# Altium schematic sheet uart.SchDoc: Zillion - Z80 Single Board Computer
size A4; Author: Francesco Sacco; Revision: 0; ProjectName: Zillion - Z80 Single Board Computer
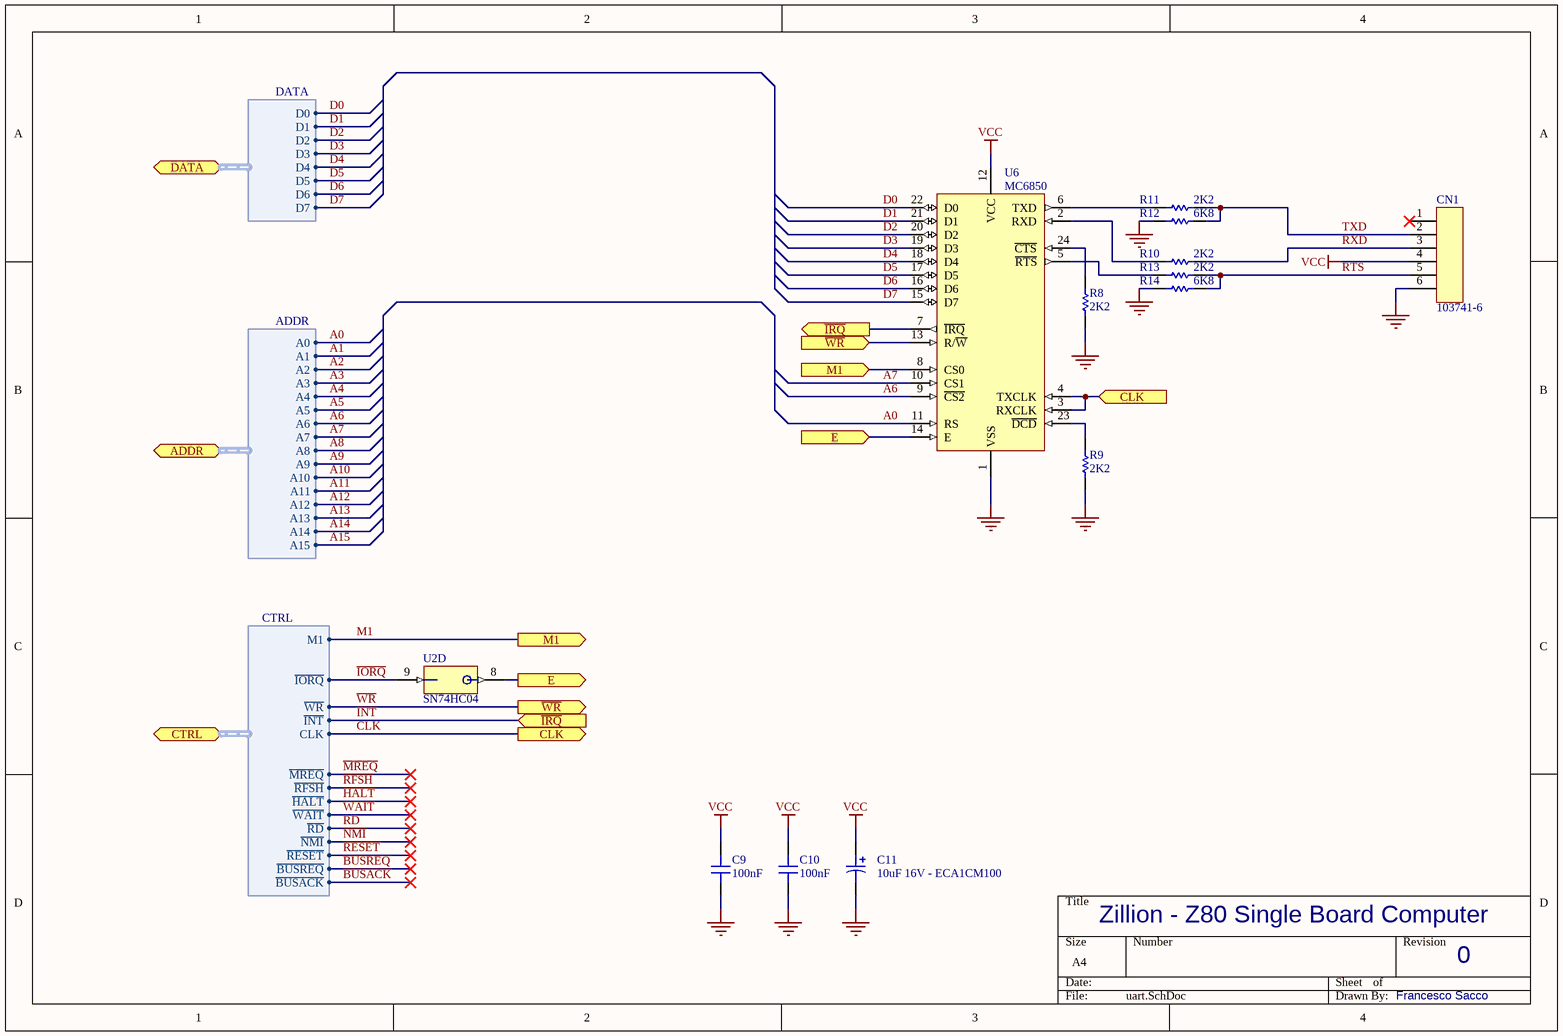
[diagram p0: uart.SchDoc]

## Parts
C9  100nF  [DiskCapacitor]
C10  100nF  [DiskCapacitor]
C11  10uF 16V - ECA1CM100  [ECA 5x11]
CN1  103741-6  [103741-6]
R8  2K2  [CR12]
R9  2K2  [CR12]
R10  2K2  [CR12]
R11  2K2  [CR12]
R12  6K8  [CR12]
R13  2K2  [CR12]
R14  6K8  [CR12]
U2  SN74HC04  [TSSOP14]  (part D of 7)
U6  MC6850  [PDIP24]

## Ports
ADDR (harness ADDR), CLK (in), CLK (out), CTRL (harness CTRL), DATA (harness DATA), E (in), E (out), M1 (in), M1 (out), ~{IRQ} (in), ~{IRQ} (out), ~{WR} (in), ~{WR} (out)

## Harnesses
ADDR: A0, A1, A2, A3, A4, A5, A6, A7, A8, A9, A10, A11, A12, A13, A14, A15
DATA: D0, D1, D2, D3, D4, D5, D6, D7
CTRL: M1, ~{MREQ}, ~{IORQ}, ~{RD}, ~{WR}, ~{RFSH}, ~{HALT}, ~{WAIT}, ~{INT}, ~{NMI}, ~{RESET}, ~{BUSREQ}, ~{BUSACK}, CLK

## Nets
GND: C9.1 C10.1 C11.2 CN1.6 R8.1 R9.1 R12.1 R14.1 U6.1(VSS)
VCC: C9.2 C10.2 C11.1 CN1.4 U6.12(VCC)
A0: U6.11(RS) ; port ADDR.A0
A1: port ADDR.A1
A2: port ADDR.A2
A3: port ADDR.A3
A4: port ADDR.A4
A5: port ADDR.A5
A6: U6.9(~{CS2}) ; port ADDR.A6
A7: U6.10(CS1) ; port ADDR.A7
A8: port ADDR.A8
A9: port ADDR.A9
A10: port ADDR.A10
A11: port ADDR.A11
A12: port ADDR.A12
A13: port ADDR.A13
A14: port ADDR.A14
A15: port ADDR.A15
~{BUSACK}: port CTRL.~{BUSACK}
~{BUSREQ}: port CTRL.~{BUSREQ}
CLK: U6.3(RXCLK) U6.4(TXCLK) ; port CLK, port CTRL.CLK
D0: U6.22(D0) ; port DATA.D0
D1: U6.21(D1) ; port DATA.D1
D2: U6.20(D2) ; port DATA.D2
D3: U6.19(D3) ; port DATA.D3
D4: U6.18(D4) ; port DATA.D4
D5: U6.17(D5) ; port DATA.D5
D6: U6.16(D6) ; port DATA.D6
D7: U6.15(D7) ; port DATA.D7
E: U2.8(Y) U6.14(E) ; port E
~{HALT}: port CTRL.~{HALT}
~{INT}: U6.7(~{IRQ}) ; port ~{IRQ}, port CTRL.~{INT}
~{IORQ}: U2.9(A) ; port CTRL.~{IORQ}
M1: U6.8(CS0) ; port M1, port CTRL.M1
~{MREQ}: port CTRL.~{MREQ}
~{NMI}: port CTRL.~{NMI}
~{RD}: port CTRL.~{RD}
~{RESET}: port CTRL.~{RESET}
~{RFSH}: port CTRL.~{RFSH}
RTS: CN1.5 R13.1 R14.2
RXD: CN1.3 R10.1
TXD: CN1.2 R11.1 R12.2
~{WAIT}: port CTRL.~{WAIT}
~{WR}: U6.13(R/~{W}) ; port ~{WR}, port CTRL.~{WR}
NetR8_2: R8.2 U6.24(~{CTS})
NetR9_2: R9.2 U6.23(~{DCD})
NetR10_2: R10.2 U6.2(RXD)
NetR11_2: R11.2 U6.6(TXD)
NetR13_2: R13.2 U6.5(~{RTS})

Not connected (* = marked no-connect by the designer): CN1 1*

## Library data of the parts
C9 C10 = Capacitor
C11 = ECA1CM100: 10uF 16V
CN1 = 103741-6: CONN Breakaway Single Row
R8-R14 = Resistor
U2 = SN74HC04: Hex Inverters
U6 = MC6850: Asynchronous Communications Interface Adapter (ACIA)